# Altium schematic sheet LoRa Radio.SchDoc
size A4
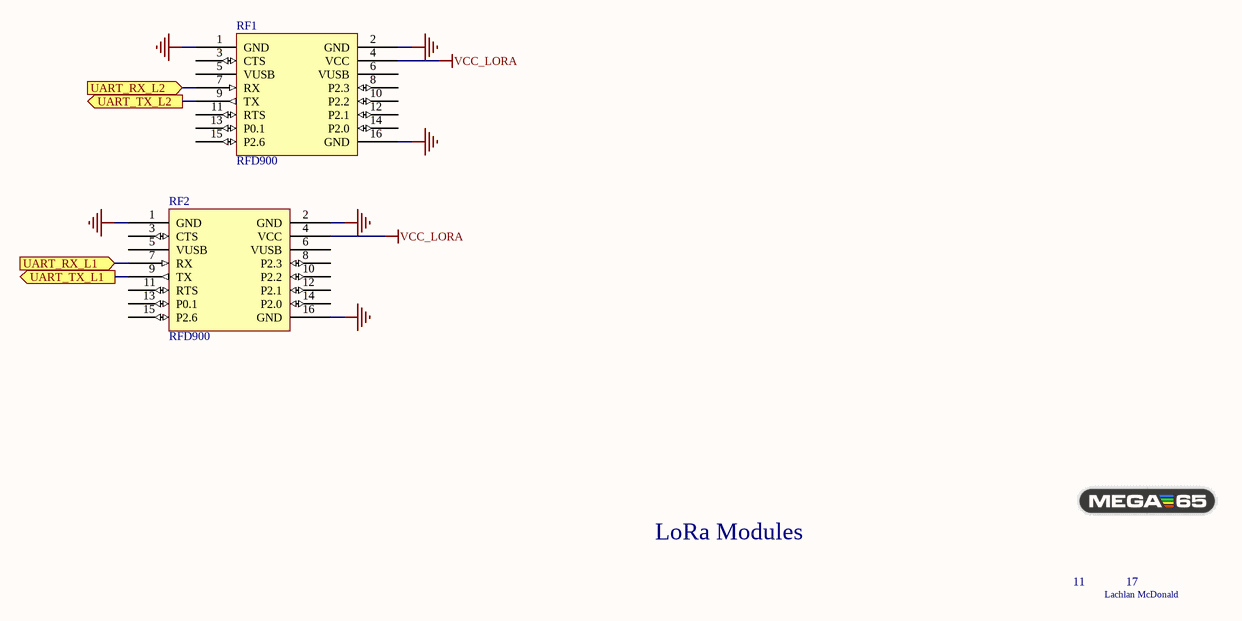
[diagram p0: LoRa Radio.SchDoc]

## Parts
RF1  RFD900  [RFD900]
RF2  RFD900  [RFD900]

## Ports
UART_RX_L1 (in), UART_RX_L2 (in), UART_TX_L1 (out), UART_TX_L2 (out)

## Nets
GND: RF1.1(GND) RF1.2(GND) RF1.16(GND) RF2.1(GND) RF2.2(GND) RF2.16(GND)
VCC_LORA: RF1.4(VCC) RF2.4(VCC)
UART_RX_L1: RF2.7(RX) ; port UART_RX_L1
UART_RX_L2: RF1.7(RX) ; port UART_RX_L2
UART_TX_L1: RF2.9(TX) ; port UART_TX_L1
UART_TX_L2: RF1.9(TX) ; port UART_TX_L2

Not connected (* = marked no-connect by the designer): RF1 3(CTS) 5(VUSB) 6(VUSB) 8(P2.3) 10(P2.2) 11(RTS) 12(P2.1) 13(P0.1) 14(P2.0) 15(P2.6); RF2 3(CTS) 5(VUSB) 6(VUSB) 8(P2.3) 10(P2.2) 11(RTS) 12(P2.1) 13(P0.1) 14(P2.0) 15(P2.6)

## Notes on the sheet
- LoRa Modules
- 11
- 17
- Lachlan McDonald
- Title
- Size:
- Date:
- A4
- Number:
- Revision:
- Sheet
- Drawn By:
- of
- File: